# Altium schematic sheet Knot_Thing_MCU.SchDoc: KNoT Thing DevBoard MCU
size A4; Organization: C.E.S.A.R; Address1: Rua Bione, 220; Address2: Bairro do Recife; Address3: Recife - PE - Brasil; Address4: 50030-390; DocumentNumber: 1; Revision: 1; SheetNumber: 2; SheetTotal: 3
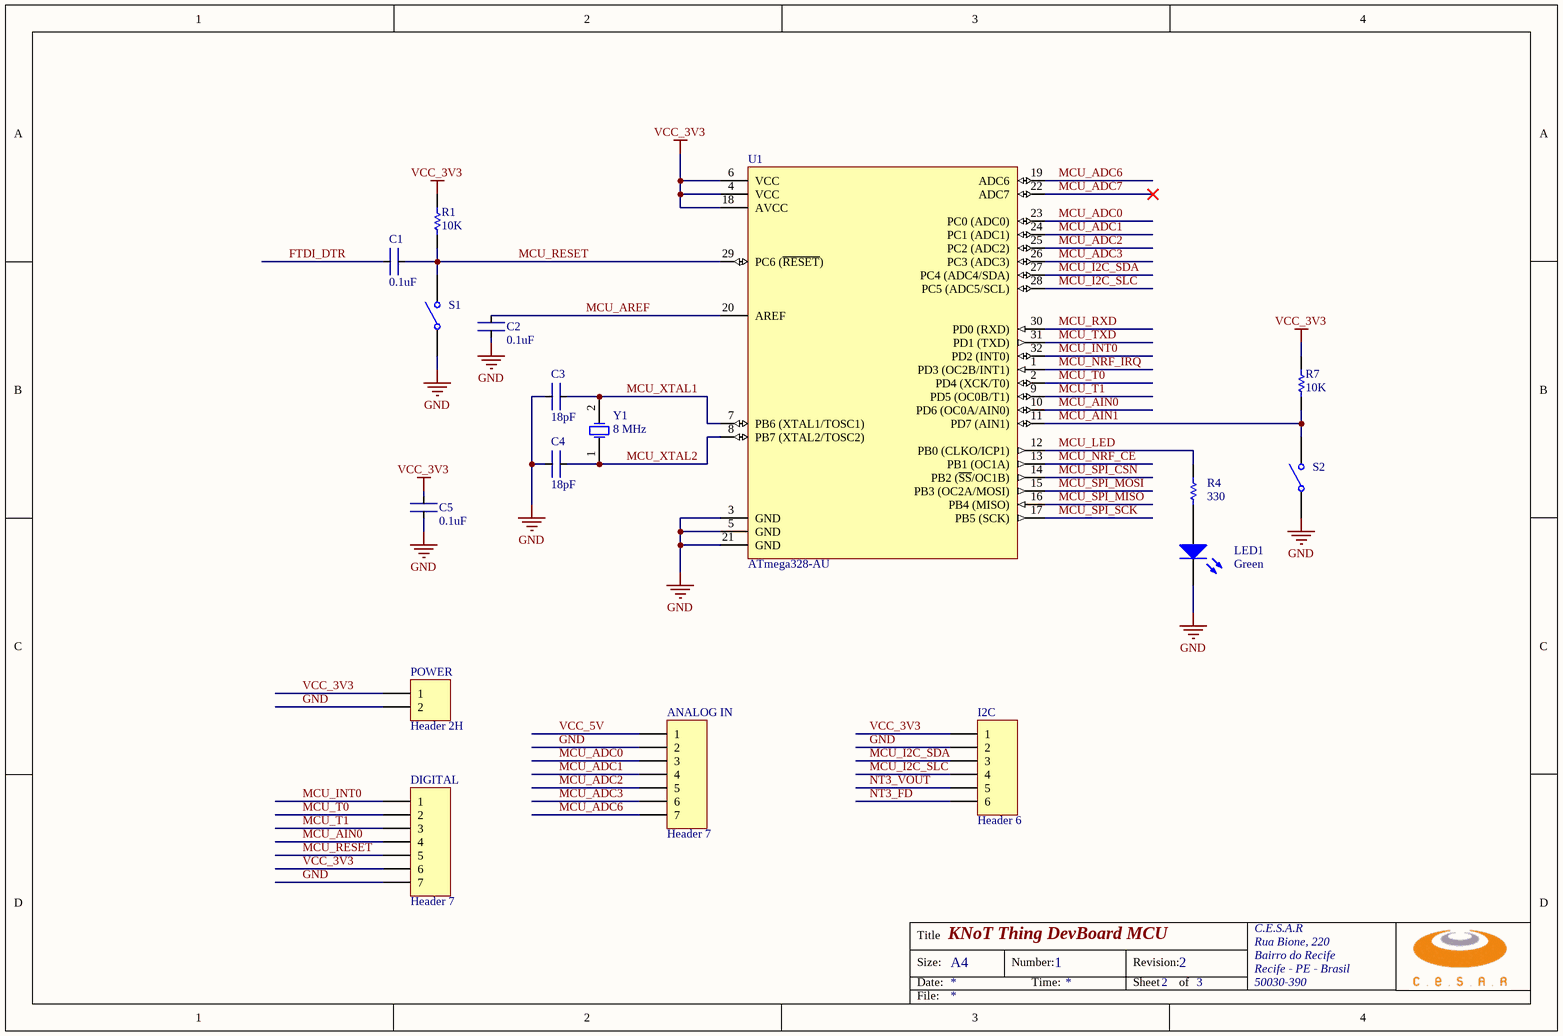
[diagram p0: Knot_Thing_MCU.SchDoc]

## Parts
ANALOG_IN  Header 7  [HDR1X7]
C1  value 0.1uF  [CAPC1005L]  (hidden comment: Cap_0402)
C2  value 0.1uF  [CAPC1005L]  (hidden comment: Cap_0402)
C3  value 18pF  [CAPC1005L]  (hidden comment: Cap_0402)
C4  value 18pF  [CAPC1005L]  (hidden comment: Cap_0402)
C5  value 0.1uF  [CAPC1005L]  (hidden comment: Cap_0402)
DIGITAL  Header 7  [HDR1X7]
I2C  Header 6  [HDR1X6]
LED1  Color: Green  [0603_LED]  (hidden comment: LED 0603)
POWER  Header 2H  [HDR1X2]
R1  value 10K  [CAPC1005L]  (hidden comment: RES_0402)
R4  value 330  [CAPC1005L]  (hidden comment: RES_0402)
R7  value 10K  [CAPC1005L]  (hidden comment: RES_0402)
S1  SW-SPST  [SWITCH TS-1181]  (value not drawn)
S2  SW-SPST  [SWITCH TS-1181]  (value not drawn)
U1  ATmega328-AU  [32A_L]
Y1  8 MHz  [CX5032GB]

## Nets
GND: ANALOG_IN.2 C2.1 C3.1 C4.1 C5.1 DIGITAL.7 I2C.2 LED1.2(K) POWER.2 S1.1(COMMON) S2.1(COMMON) U1.3(GND) U1.5(GND) U1.21(GND)
VCC_3V3: C5.2 DIGITAL.6 I2C.1 POWER.1 R1.2 R7.2 U1.4(VCC) U1.6(VCC) U1.18(AVCC)
FTDI_DTR: C1.1
MCU_ADC0: ANALOG_IN.3 U1.23(PC0_(ADC0))
MCU_ADC1: ANALOG_IN.4 U1.24(PC1_(ADC1))
MCU_ADC2: ANALOG_IN.5 U1.25(PC2_(ADC2))
MCU_ADC3: ANALOG_IN.6 U1.26(PC3_(ADC3))
MCU_ADC6: ANALOG_IN.7 U1.19(ADC6)
MCU_ADC7: U1.22(ADC7)
MCU_AIN0: DIGITAL.4 U1.10(PD6_(OC0A/AIN0))
MCU_AIN1: R7.1 S2.2(NO) U1.11(PD7_(AIN1))
MCU_AREF: C2.2 U1.20(AREF)
MCU_I2C_SDA: I2C.3 U1.27(PC4_(ADC4/SDA))
MCU_I2C_SLC: I2C.4 U1.28(PC5_(ADC5/SCL))
MCU_INT0: DIGITAL.1 U1.32(PD2_(INT0))
MCU_LED: R4.2 U1.12(PB0_(CLKO/ICP1))
MCU_NRF_CE: U1.13(PB1_(OC1A))
MCU_NRF_IRQ: U1.1(PD3_(OC2B/INT1))
MCU_RESET: C1.2 DIGITAL.5 R1.1 S1.2(NO) U1.29(PC6_(~{RESET}))
MCU_RXD: U1.30(PD0_(RXD))
MCU_SPI_CSN: U1.14(PB2_(~{SS}/OC1B))
MCU_SPI_MISO: U1.16(PB4_(MISO))
MCU_SPI_MOSI: U1.15(PB3_(OC2A/MOSI))
MCU_SPI_SCK: U1.17(PB5_(SCK))
MCU_T0: DIGITAL.2 U1.2(PD4_(XCK/T0))
MCU_T1: DIGITAL.3 U1.9(PD5_(OC0B/T1))
MCU_TXD: U1.31(PD1_(TXD))
MCU_XTAL1: C3.2 U1.7(PB6_(XTAL1/TOSC1)) Y1.2(OSC2)
MCU_XTAL2: C4.2 U1.8(PB7_(XTAL2/TOSC2)) Y1.1(OSC1)
NT3_FD: I2C.6
NT3_VOUT: I2C.5
VCC_5V: ANALOG_IN.1
NetLED1_1: LED1.1(A) R4.1

## Notes on the sheet
- Title
- Size:
- Date:
- A4
- Number:
- Time:
- Revision:
- Sheet
- 2
- of
- File:

## Library data of the parts
ANALOG_IN DIGITAL = Header 7: Header, 7-Pin; LatestRevisionDate: 17-Jul-2002; LatestRevisionNote: Re-released for DXP Platform.; Publisher: Altium Limited
C1-C5 = Capacitor_0402: Chip Capacitor 0402 (1005 metric); Supplier 1: Digi-Key
  C1 C2 C5: Supplier Part Number 1: 311-1731-1-ND
  C3 C4: Supplier Part Number 1: 311-1415-1-ND
I2C = Header 6: Header, 6-Pin; LatestRevisionDate: 17-Jul-2002; LatestRevisionNote: Re-released for DXP Platform.; Publisher: Altium Limited
LED1 = LED 0603: LED SMD 0603; Supplier 1: Digi-Key; Supplier Part Number 1: 754-1790-1-ND
POWER = Header 2H: Header, 2-Pin, Right Angle; LatestRevisionDate: 17-Jul-2002; LatestRevisionNote: Re-released for DXP Platform.; Publisher: Altium Limited
R1 R4 R7 = RES_0402: Precision Thick Film Chip Resistor, 10 Ohm to 1M Ohm Range, 1% and 0.5% Tolerance, 0805 Size, 1/8 W; Supplier 1: Digi-Key
  R1 R7: Supplier Part Number 1: 311-2131-1-ND
  R4: Supplier Part Number 1: 311-330JRCT-ND
S1 S2 = SW-SPST: Single-Pole, Single-Throw Switch; Published: 24-Mar-1999; LatestRevisionDate: 17-Jul-2002; LatestRevisionNote: Re-released for DXP Platform.; PackageReference: SPST-2; Publisher: Altium Limited; PackageDescription: Switch; 2 Leads; Supplier 1: Digi-Key; Supplier Part Number 1: CKN10384CT-ND
U1 = ATmega328-AU: 8-bit AVR Microcontroller, 32KB Flash, 1KB EEPROM, 2KB SRAM, 32-pin TQFP, Industrial Grade (-40°C to 85°C); DatasheetVersion: revD, May-2011; PackageVersion: revC, Oct-2010; PackageReference: 32A; PackageDescription: 32-Lead, 7x7x1.0 mm Body, 0.8mm Lead Pitch, Thin Profile Plastic Quad Flat Package (TQFP); Code_JEDEC: MS-026-ABA; ComponentLink1Description: Manufacturer URL; ComponentLink1URL: http://www.atmel.com/; ComponentLink2Description: ATmega48A/48PA/88A/88PA/168A/168PA/328/328P Datasheet; ComponentLink2URL: http://www.atmel.com/dyn/resources/prod_documents/doc8271.pdf; ComponentLink3Description: ATmega48A/48PA/88A/88PA/168A/168PA/328/328P Summary; ComponentLink3URL: http://www.atmel.com/dyn/resources/prod_documents/8271S.pdf; Supplier 1: Digi-Key; Supplier Part Number 1: ATMEGA328-AU-ND
Y1 = XTAL: Crystal FOXSLF/080-20; Supplier 1: Digi-Key; Supplier Part Number 1: 1253-1373-1-ND